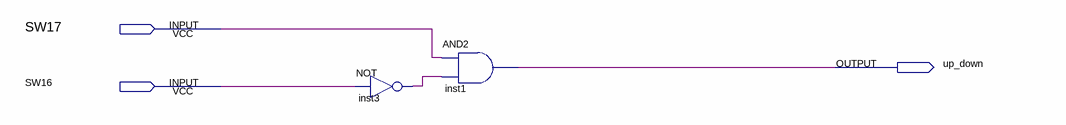
[diagram p0: schematic sheet]
// Quartus schematic mux_op.bdf as structural Verilog: 2 symbols, 3 pins
module mux_op (
  input  SW17,
  input  SW16,
  output up_down
);

  wire inst3_out;

  not inst3 (inst3_out, SW16);
  and inst1 (up_down, SW17, inst3_out);
endmodule
